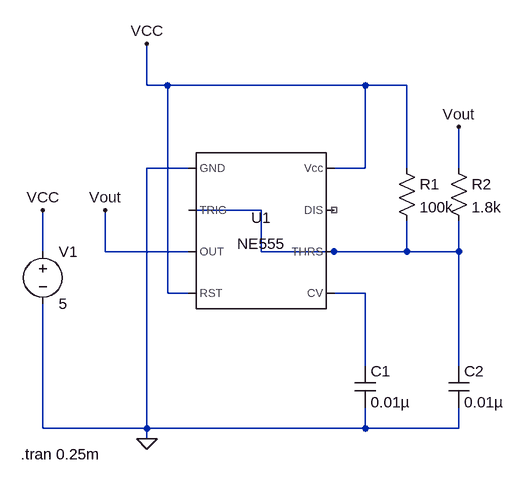
[diagram p0: schematic AstableMultivibrator.asc]
AstableMultivibrator.asc, the LTspice schematic file:
Version 4
SHEET 1 880 680
WIRE 16 -48 16 -112
WIRE 48 -48 16 -48
WIRE 352 -48 48 -48
WIRE 416 -48 352 -48
WIRE 80 80 16 80
WIRE 352 80 352 -48
WIRE 352 80 304 80
WIRE 416 80 416 -48
WIRE 496 80 496 16
WIRE 192 144 80 144
WIRE -144 208 -144 144
WIRE -48 208 -48 144
WIRE 80 208 -48 208
WIRE 192 208 192 144
WIRE 304 208 192 208
WIRE 416 208 416 160
WIRE 416 208 304 208
WIRE 496 208 496 160
WIRE 496 208 416 208
WIRE 48 272 48 -48
WIRE 80 272 48 272
WIRE 352 272 304 272
WIRE 352 384 352 272
WIRE 496 384 496 208
WIRE -144 480 -144 288
WIRE 16 480 16 80
WIRE 16 480 -144 480
WIRE 352 480 352 448
WIRE 352 480 16 480
WIRE 496 480 496 448
WIRE 496 480 352 480
WIRE 16 496 16 480
FLAG 16 496 0
FLAG -144 144 VCC
FLAG 16 -112 VCC
FLAG -48 144 Vout
FLAG 496 16 Vout
SYMBOL Misc\\NE555 192 176 R0
SYMATTR InstName U1
SYMBOL cap 336 384 R0
SYMATTR InstName C1
SYMATTR Value 0.01µ
SYMBOL voltage -144 192 R0
WINDOW 123 0 0 Left 0
WINDOW 39 0 0 Left 0
SYMATTR InstName V1
SYMATTR Value 5
SYMBOL cap 480 384 R0
SYMATTR InstName C2
SYMATTR Value 0.01µ
SYMBOL res 480 64 R0
SYMATTR InstName R2
SYMATTR Value 1.8k
SYMBOL res 400 64 R0
SYMATTR InstName R1
SYMATTR Value 100k
TEXT -178 520 Left 2 !.tran 0.25m

The netlist it stands for:
* AstableMultivibrator.asc
XU1 0 N001 Vout VCC N002 N001 NC_01 VCC NE555  ; pins GND TRIG OUT RST CV THRS DIS Vcc
C1 N002 0 0.01µ
V1 VCC 0 5
C2 N001 0 0.01µ
R2 Vout N001 1.8k
R1 VCC N001 100k
.tran 0.25m
.lib NE555.sub
.backanno
.end